# Altium schematic sheet 4_SD_Card_NFC.SchDoc
size A4; SheetNumber: 4; SheetTotal: 4
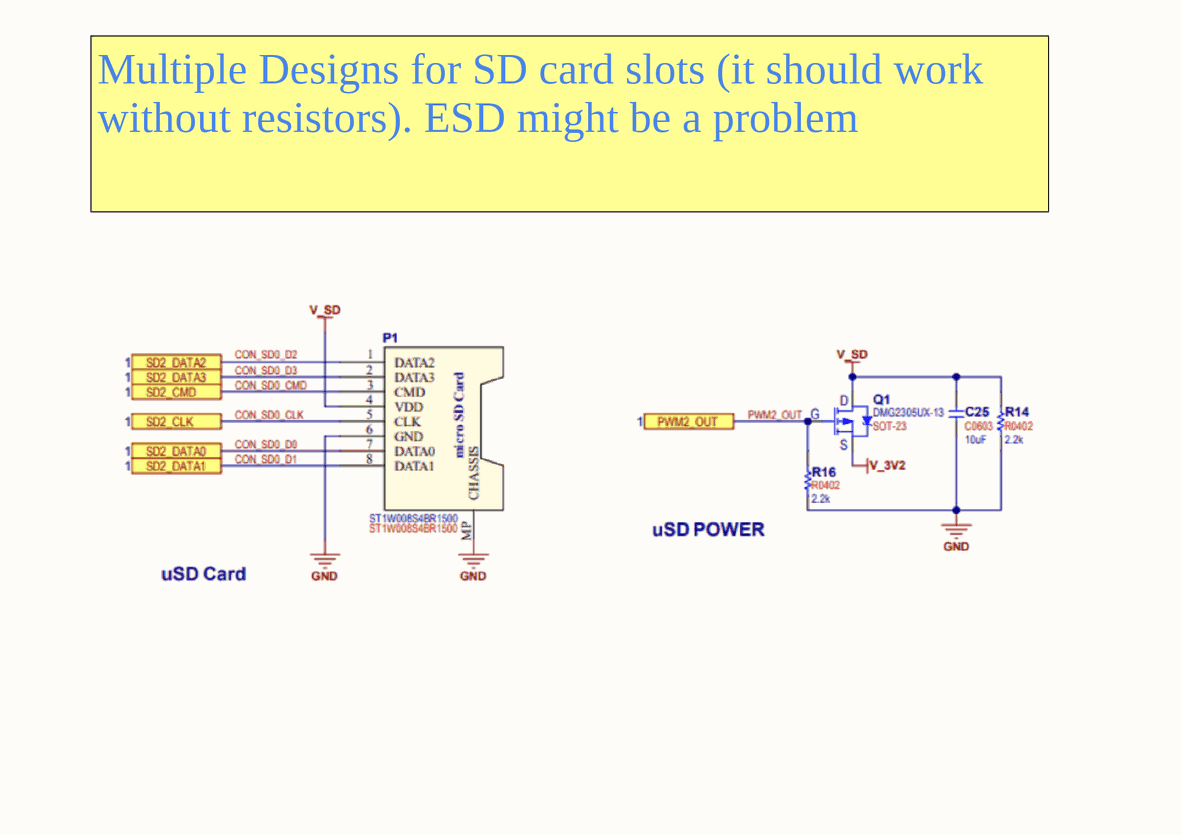
[diagram p0: 4_SD_Card_NFC.SchDoc, top middle]
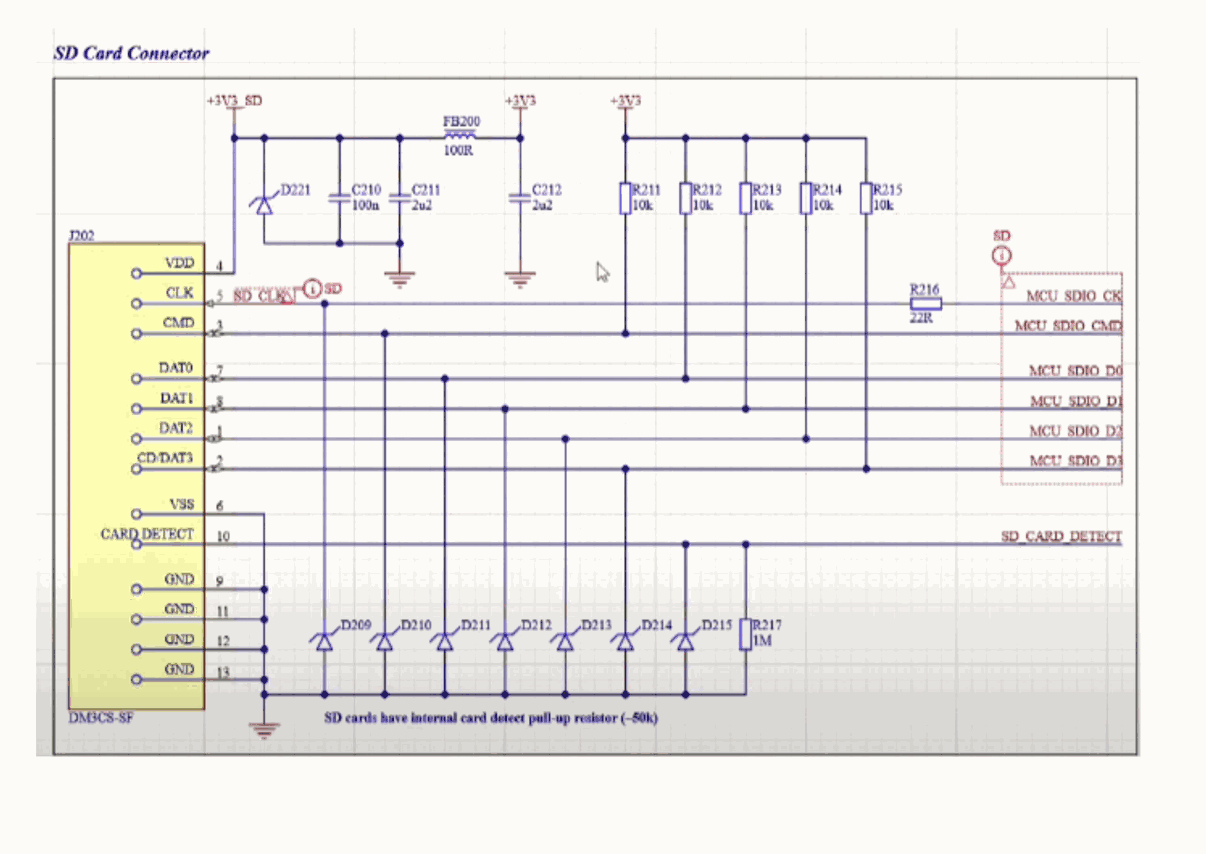
[diagram p1: 4_SD_Card_NFC.SchDoc, bottom left]
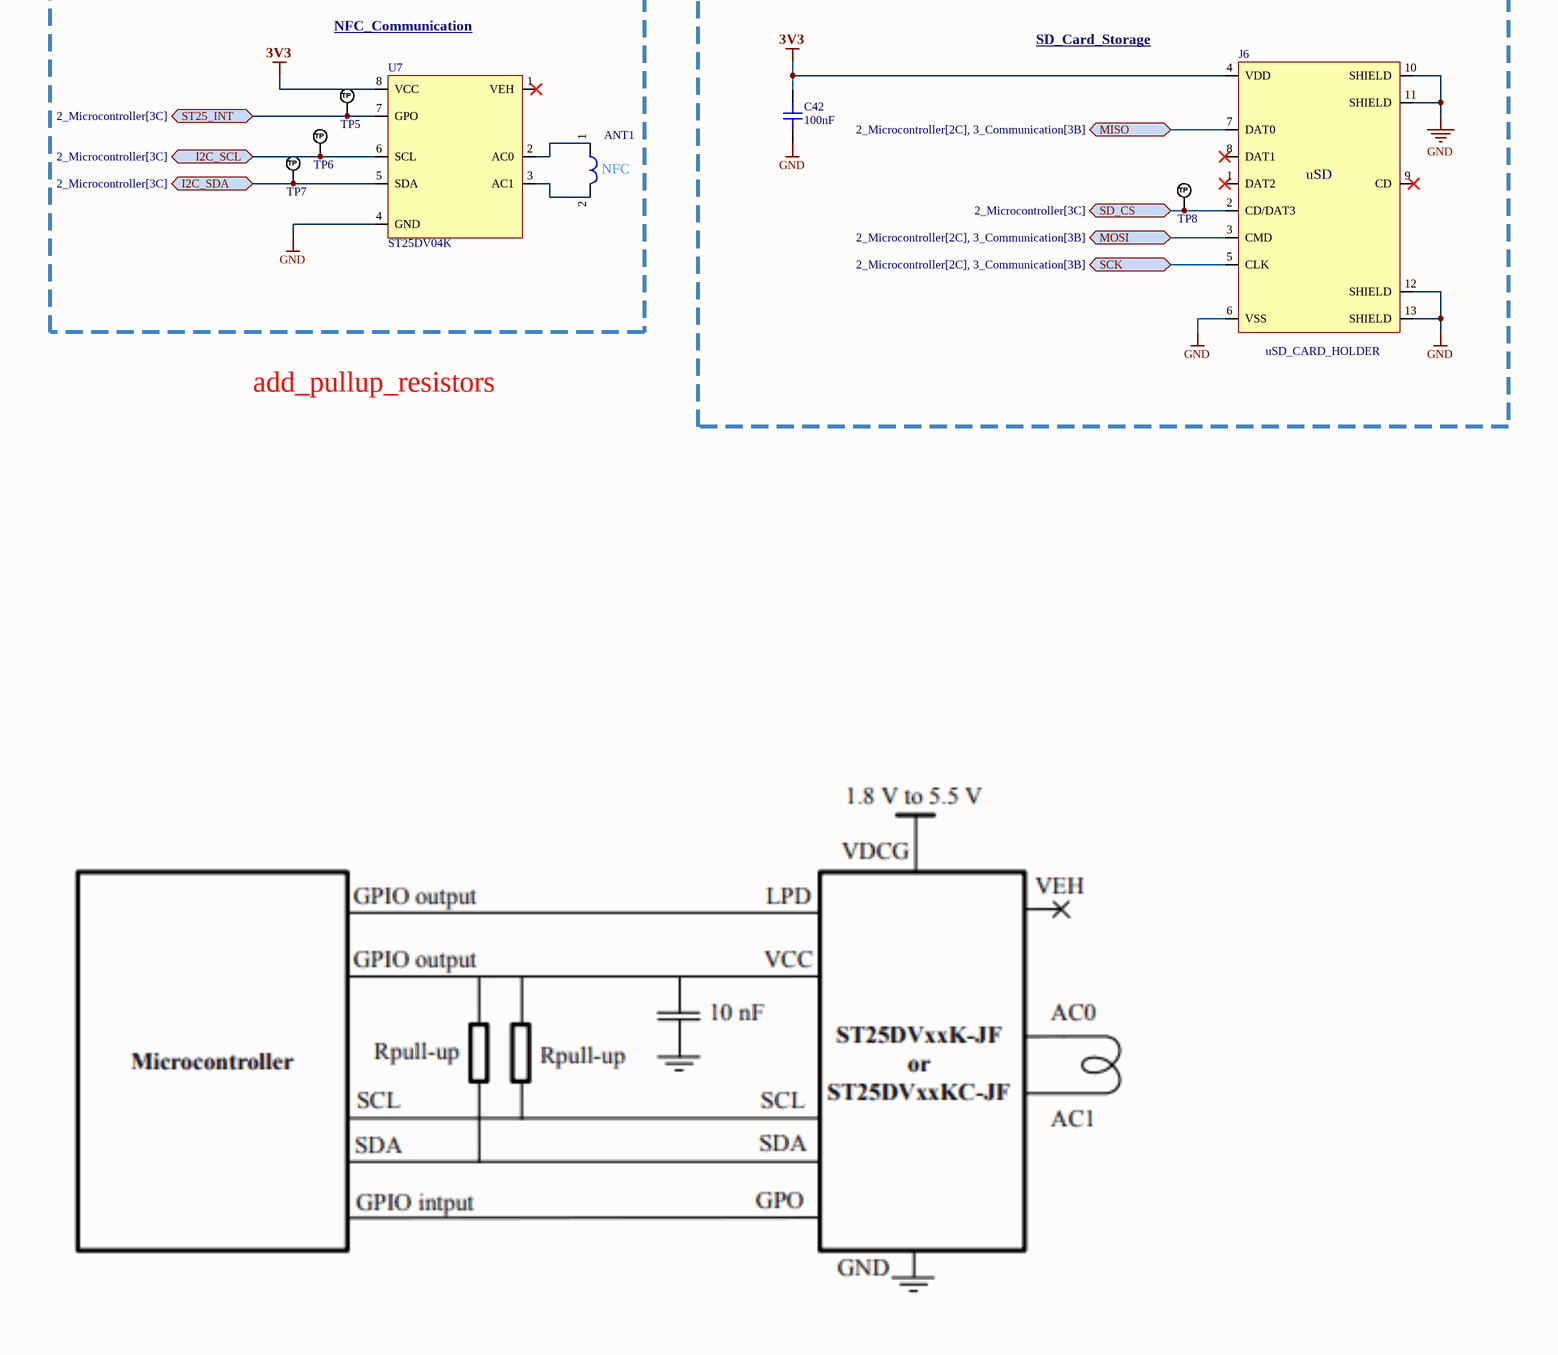
[diagram p2: 4_SD_Card_NFC.SchDoc, bottom middle]
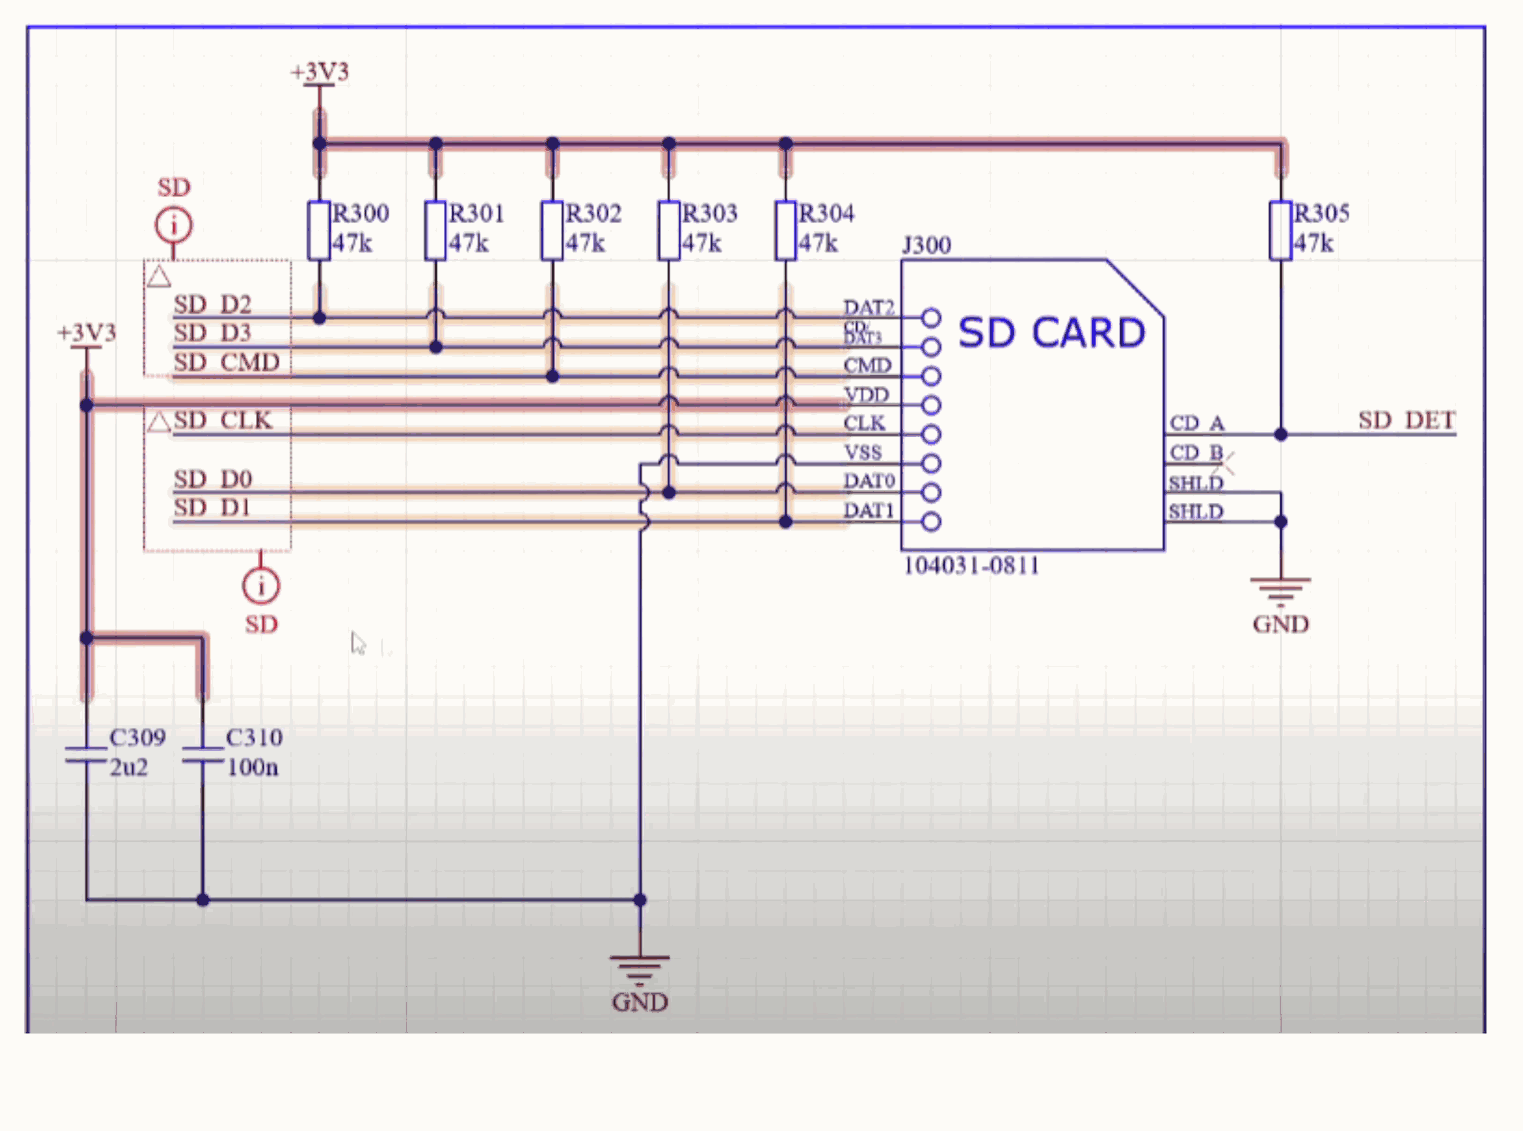
[diagram p3: 4_SD_Card_NFC.SchDoc, bottom right]

## Parts
ANT1  NFC_ANTENNA  (value not drawn)
C42  100nF  [CAP_0603]
J6  uSD_CARD_HOLDER
TP5  TP_NOBOM  [PAD_RND_1MM]  (value not drawn)  (no BOM)
TP6  TP_NOBOM  [PAD_RND_1MM]  (value not drawn)  (no BOM)
TP7  TP_NOBOM  [PAD_RND_1MM]  (value not drawn)  (no BOM)
TP8  TP_NOBOM  [PAD_RND_1MM]  (value not drawn)  (no BOM)
U7  ST25DV04K

## Ports
I2C_SCL (bidir, see 2_Microcontroller[3C]), I2C_SDA (bidir, see 2_Microcontroller[3C]), MISO (bidir, see 2_Microcontroller[2C], 3_Communication[3B]), MOSI (bidir, see 2_Microcontroller[2C], 3_Communication[3B]), SCK (bidir, see 2_Microcontroller[2C], 3_Communication[3B]), SD_CS (bidir, see 2_Microcontroller[3C]), ST25_INT (bidir, see 2_Microcontroller[3C])

## Nets
3V3: C42.2 J6.4(VDD) U7.8(VCC)
GND: C42.1 J6.6(VSS) J6.10(SHIELD) J6.11(SHIELD) J6.12(SHIELD) J6.13(SHIELD) U7.4(GND)
I2C_SCL: TP6.1(TP) U7.6(SCL) ; port I2C_SCL
I2C_SDA: TP7.1(TP) U7.5(SDA) ; port I2C_SDA
MISO: J6.7(DAT0) ; port MISO
MOSI: J6.3(CMD) ; port MOSI
SCK: J6.5(CLK) ; port SCK
SD_CS: J6.2(CD/DAT3) TP8.1(TP) ; port SD_CS
ST25_INT: TP5.1(TP) U7.7(GPO) ; port ST25_INT
NetANT1_1: ANT1.1 U7.2(AC0)
NetANT1_2: ANT1.2 U7.3(AC1)

Not connected (* = marked no-connect by the designer): J6 1(DAT2)* 8(DAT1)* 9(CD)*; U7 1(VEH)*

## Notes on the sheet
- Multiple Designs for SD card slots (it should work without resistors). ESD might be a problem
- NFC_Communication
- SD_Card_Storage
- add_pullup_resistors
- (in symbol NFC_ANTENNA) NFC
- (in symbol uSD_CARD) uSD

## Library data of the parts
C42 = CAP_0603: Capacitor SMD 0603; Manufacturer: *; Manufacturer Part Number: *; Distributor Link: *; LCSC: *; Rating: *; Dielectric: *
J6 = uSD_CARD
TP5-TP8 = TEST_POINT_RND_1MM: Test Point Round 1mm (NO BOM)
U7 = ST25DV04K: ST25DO4K NFC module with I2C